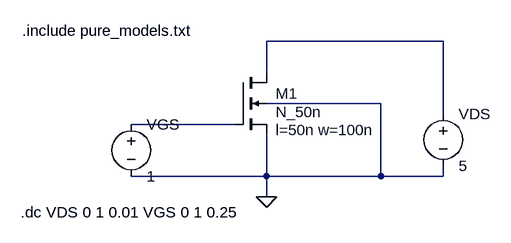
[diagram p0: schematic noms_sc.asc]
noms_sc.asc, the LTspice schematic file:
Version 4
SHEET 1 880 680
WIRE 416 48 144 48
WIRE 144 96 144 48
WIRE 320 144 144 144
WIRE 416 160 416 48
WIRE 96 176 -64 176
WIRE 144 256 144 192
WIRE 144 256 -64 256
WIRE 320 256 320 144
WIRE 320 256 144 256
WIRE 416 256 416 240
WIRE 416 256 320 256
WIRE 144 288 144 256
FLAG 144 288 0
SYMBOL nmos4 96 96 R0
WINDOW 0 62 33 Left 2
WINDOW 3 62 61 Left 2
WINDOW 123 62 89 Left 2
SYMATTR InstName M1
SYMATTR Value N_50n
SYMATTR Value2 l=50n w=100n
SYMBOL voltage 416 144 R0
WINDOW 123 0 0 Left 0
WINDOW 39 0 0 Left 0
SYMATTR InstName VDS
SYMATTR Value 5
SYMBOL voltage -64 160 R0
WINDOW 123 0 0 Left 0
WINDOW 39 0 0 Left 0
SYMATTR InstName VGS
SYMATTR Value 1
TEXT -232 32 Left 2 !.include pure_models.txt
TEXT -234 312 Left 2 !.dc VDS 0 1 0.01 VGS 0 1 0.25

The netlist it stands for:
* noms_sc.asc
M1 N001 N002 0 0 N_50n l=50n w=100n
VDS N001 0 5
VGS N002 0 1
.model NMOS NMOS
.model PMOS PMOS
.lib standard.mos
.include pure_models.txt
.dc VDS 0 1 0.01 VGS 0 1 0.25
.backanno
.end